# Altium schematic sheet TSAL.SchDoc
size A4
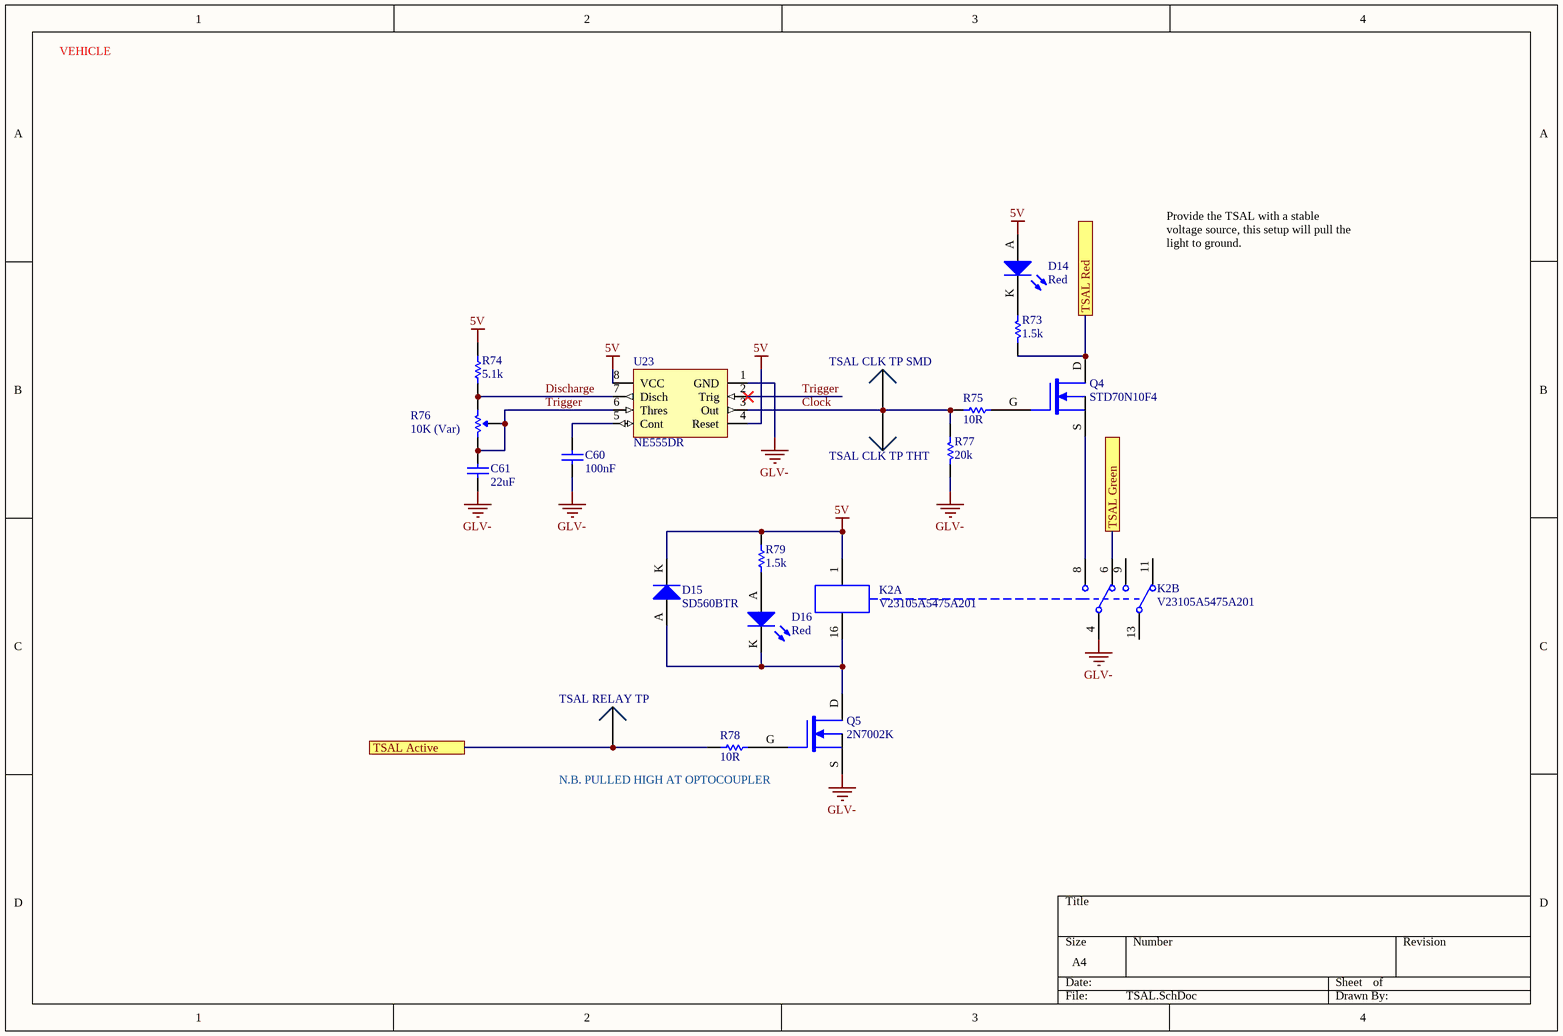
[diagram p0: TSAL.SchDoc]

## Parts
C60  100nF  [0805]
C61  22uF  [1206]
D14  Red  [0805 LED]
D15  SD560BTR  [SMB Diode]
D16  Red  [0805 LED]
K2  V23105A5475A201  [TI 2-DIL]  (parts A,B of 2)
Q4  STD70N10F4  [STM TO-252 MOSFET]
Q5  2N7002K  [ON SOT-23 MOSFET]
R73  1.5k  [0805]
R74  5.1k  [0805]
R75  10R  [0805]
R76  10K (Var)  [B 3296]
R77  20k  [0805]
R78  10R  [0805]
R79  1.5k  [0805]
TSAL_CLK_TP_SMD  0mm  [SMD Test Point]  (value not drawn)
TSAL_CLK_TP_THT  0mm  [TH Test Point]  (value not drawn)
TSAL_RELAY_TP  0mm  [SMD Test Point]  (value not drawn)
U23  NE555DR  [TI 8-SOIC]

## Ports
TSAL Active, TSAL Green, TSAL Red

## Nets
5V: D14.A D15.K K2.1 R74.2 R79.2 U23.4(Reset) U23.8(VCC)
GLV-: C60.1 C61.1 K2.4 Q5.S R77.1 U23.1(GND)
Clock: R75.1 R77.2 TSAL_CLK_TP_SMD.1 TSAL_CLK_TP_THT.1 U23.3(Out)
Discharge: R74.1 R76.3(CW) U23.7(Disch)
Trigger: C61.2 R76.1(CCW) R76.2(Wiper) U23.2(Trig) U23.6(Thres)
TSAL Active: R78.1 TSAL_RELAY_TP.1 ; port TSAL Active
TSAL Green: K2.6 ; port TSAL Green
TSAL Red: Q4.D R73.1 ; port TSAL Red
NetC60_2: C60.2 U23.5(Cont)
NetD14_K: D14.K R73.2
NetD15_A: D15.A D16.K K2.16 Q5.D
NetD16_A: D16.A R79.1
NetK2_8: K2.8 Q4.S
NetQ4_G: Q4.G R75.2
NetQ5_G: Q5.G R78.2

Not connected (* = marked no-connect by the designer): K2 9 11 13

## Notes on the sheet
- VEHICLE
- Provide the TSAL with a stable voltage source, this setup will pull the light to ground.
- (near R78) N.B. PULLED HIGH AT OPTOCOUPLER

## Library data of the parts
C60 = GCM21BR71H104KA37L: Manufacturer: muRata; Tolerance: ±10%; Material: X7R; Rated Voltage: 50V; Part Number: GCM21BR71H104KA37L; Value: 100nF; Digikey Part Number: 490-6064-1-ND
C61 = CC1206MKX5R7BB226: Manufacturer: YAGEO; Tolerance: 20%; Material: Ceramic; Rated Voltage: 16V; Part Number: CC1206MKX5R7BB226; Value: 22uF; Digikey Part Number: 311-1997-2-ND
D14 D16 = SML-210LTT86: Red LED Indication - Discrete 1.75V 0805 (2012 Metric); Manufacturer: ROHM Semiconductor; Part Number: SML-210LTT86; Colour: Red; Digikey Part Number: 511-1286-1-ND; Digikey Link: https://www.digikey.com/product-detail/en/rohm-semiconductor/SML-210LTT86/511-1286-1-ND/637099
D15 = SD560BTR: 1.2V_F 600V 5A SMB; Manufacturer: SMC Diode Solutions; Part Number: SD560BTR; Digikey Part Number: 1655-1530-2-ND; Digikey Link: https://www.digikey.com/product-detail/en/smc-diode-solutions/SD560BTR/1655-1530-2-ND/6022620
K2 = V23105A5475A201: 5V DPDT Relay 3A 220VDC; Manufacturer: Axicom; Part Number: V23105A5475A201; Digikey Part Number: PB383-ND; Digikey Link: https://www.digikey.com/products/en?mpart=V23105A5001A201&v=41
Q4 = STD70N10F4: N-Channel 100V 60A (Tc) 125W (Tc) Surface Mount DPAK; Manufacturer: STMicroelectronics; Published: 24-Mar-1999; LatestRevisionDate: 29-May-2009; LatestRevisionNote: IPC-7351 Footprint Added.; PackageVersion: Sep-2000; PackageReference: SOT-343; Publisher: Altium Limited; PackageDescription: 4-Pin SOT-343 Package 1.3 mm Pitch, 2.1 mm Lead Span; Part Number: STD70N10F4; Digikey Part Number: 497-8806-2-ND; Digikey Link: https://www.digikey.com/product-detail/en/stmicroelectronics/STD70N10F4/497-8806-2-ND/2035599
Q5 = 2N7002K: 60V 380mA, NFET MOSTFET (Small Signal); Manufacturer: ON Semiconductor; Published: 24-Mar-1999; LatestRevisionDate: 29-May-2009; LatestRevisionNote: IPC-7351 Footprint Added.; PackageVersion: Sep-2000; PackageReference: SOT-343; Publisher: Altium Limited; PackageDescription: 4-Pin SOT-343 Package 1.3 mm Pitch, 2.1 mm Lead Span; Part Number: 2N7002K; Digikey Part Number: 2N7002KCT-ND; Digikey Link: https://www.digikey.com/product-detail/en/on-semiconductor/2N7002K/2N7002KCT-ND/2060375; Qty: 30
R73 R79 = RC0805FR071K5L: Manufacturer: YAGEO; Tolerance: 0.01; Rated Voltage: 0.125W; Part Number: RC0805FR071K5L; Value: 1.5k; Material: FR-07; Digikey Part Number: 311-1.50KCRCT-ND
R74 = RC0805FR075K1L: Manufacturer: YAGEO; Tolerance: 0.01; Rated Voltage: 0.125W; Part Number: RC0805FR075K1L; Value: 5.1k; Material: FR-07; Digikey Part Number: 311-5.10KCRCT-ND
R75 R78 = RC0805FR0710RL: Manufacturer: YAGEO; Tolerance: 0.01; Rated Voltage: 0.125W; Part Number: RC0805FR0710RL; Value: 10R; Material: FR-07; Digikey Part Number: 311-10.0CRCT-ND
R76 = 3296W-1-103LF: Manufacturer: Bournes Inc; Tolerance: 0.1; Rated Voltage: 0.5W; Part Number: 3296W-1-103LF; Value: 10K (Var); Digikey Part Number: 3296W-103LF-ND
R77 = RC0805FR0720KL: Manufacturer: YAGEO; Tolerance: 0.01; Rated Voltage: 0.125W; Part Number: RC0805FR0720KL; Value: 20k; Material: FR-07; Digikey Part Number: 311-20.0KCRCT-ND
TSAL_CLK_TP_SMD TSAL_RELAY_TP = SMD Test Point: Positions: 1; Row Spacing: 0; Flange: No; Contact: NA; Part Number: SMD Test Point; Pitch: 0mm; Angle: 0
TSAL_CLK_TP_THT = TH Test Point: Positions: 1; Angle: 0; Flange: No; Contact: NA; Part Number: TH Test Point; Pitch: 0mm; Row Spacing: 0mm
U23 = NE555DR: IC OSC SGL TIMER 100KHZ 8-SOIC; Manufacturer: Texas Instruments; Part Number: NE555DR; Digikey Part Number: 296-6501-1-ND; Digikey Link: https://www.digikey.com.au/product-detail/en/texas-instruments/NE555DR/296-6501-1-ND/372490